# EAGLE design MCU Board (EAGLE 9.3.0)
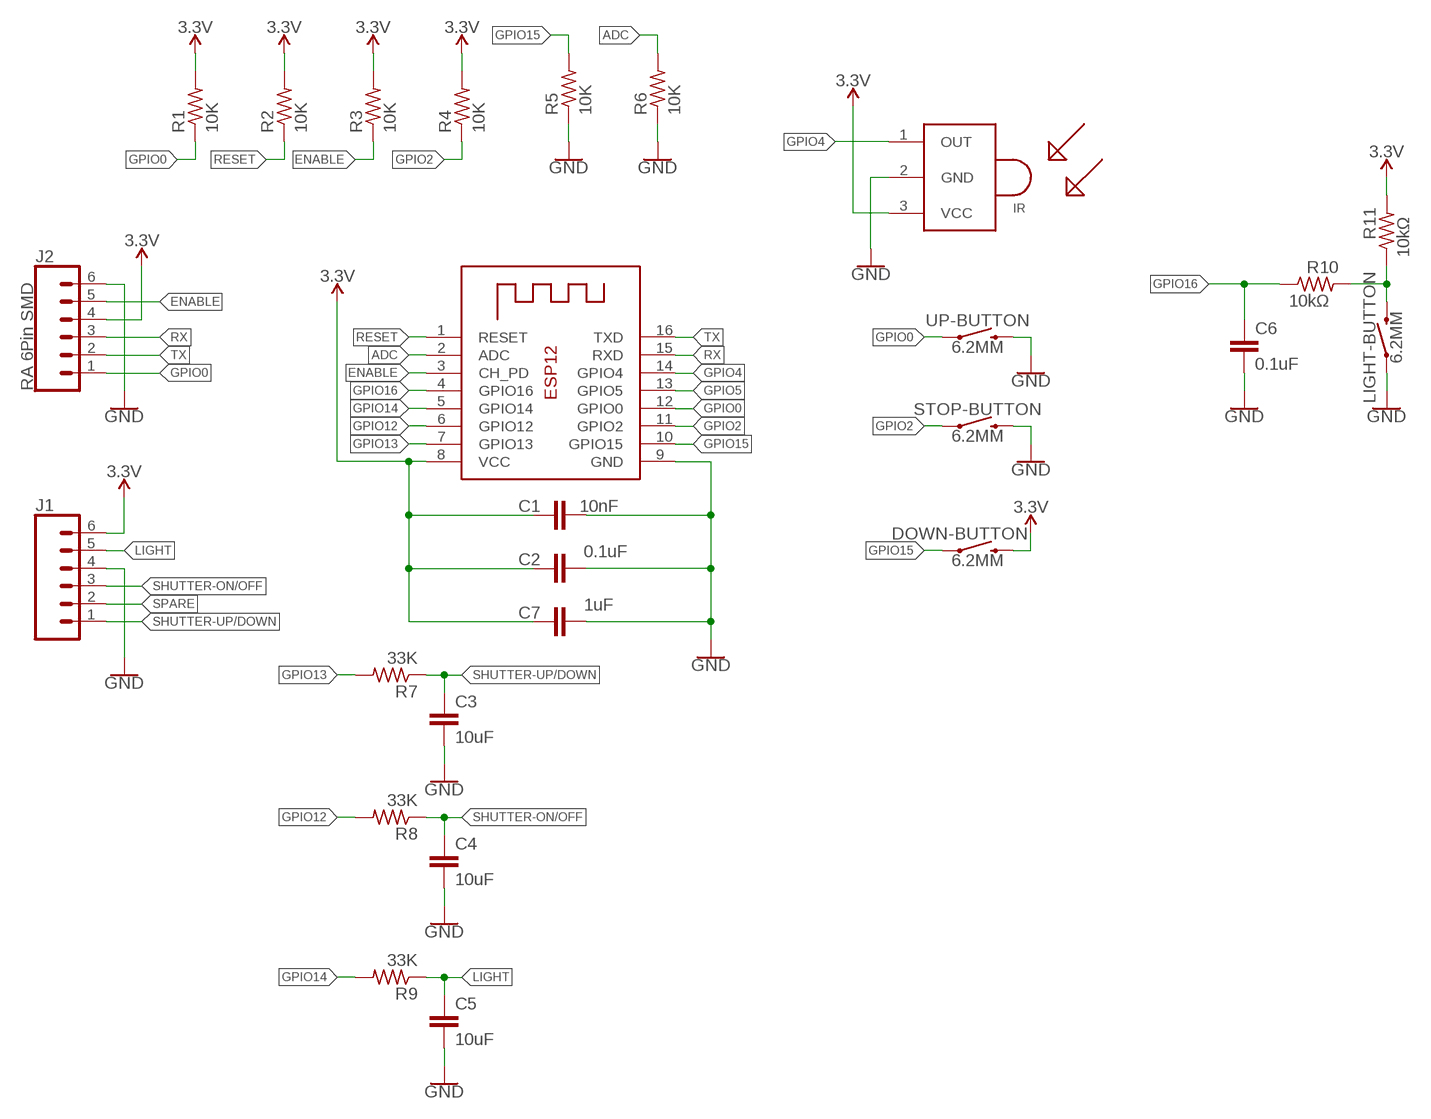
[diagram p0: schematic, sheet 1]

## Parts
C1  10nF  C-EUC0805  [C0805]
C2  0.1uF  C-EUC0805  [C0805]
C3  10uF  C-EUC0805  [C0805]
C4  10uF  C-EUC0805  [C0805]
C5  10uF  C-EUC0805  [C0805]
C6  0.1uF  C-EUC0805  [C0805]
C7  1uF  C-EUC0805  [C0805]
DOWN-BUTTON  6.2MM  MOMENTARY-SWITCH-SPST-SMD-6.2MM-TALL  [TACTILE_SWITCH_SMD_6.2MM_TALL]
IR  TSOP382  [TSOP382**-VERTICAL]
J1  CONN_06LOCK  [1X06_LOCK]
J2  RA 6Pin SMD  CONN_06SMD  [1X06-SMD_RA_MALE]
LIGHT-BUTTON  6.2MM  MOMENTARY-SWITCH-SPST-SMD-6.2MM-TALL  [TACTILE_SWITCH_SMD_6.2MM_TALL]
R1  10K  R-US_R0805  [R0805]
R2  10K  R-US_R0805  [R0805]
R3  10K  R-US_R0805  [R0805]
R4  10K  R-US_R0805  [R0805]
R5  10K  R-US_R0805  [R0805]
R6  10K  R-US_R0805  [R0805]
R7  33K  R-US_R0805  [R0805]
R8  33K  R-US_R0805  [R0805]
R9  33K  R-US_R0805  [R0805]
R10  10kΩ  R-US_R0805  [R0805]
R11  10kΩ  R-US_R0805  [R0805]
STOP-BUTTON  6.2MM  MOMENTARY-SWITCH-SPST-SMD-6.2MM-TALL  [TACTILE_SWITCH_SMD_6.2MM_TALL]
UP-BUTTON  6.2MM  MOMENTARY-SWITCH-SPST-SMD-6.2MM-TALL  [TACTILE_SWITCH_SMD_6.2MM_TALL]
X1  ESP-12  [ESP-12]

## Nets
3.3V: C1.1 C2.1 C7.1 DOWN-BUTTON.B2 IR.3(VCC) J1.6 J2.4 R1.2 R2.2 R3.2 R4.2 R11.2 X1.8(VCC)
ADC: R6.2 X1.2(ADC)
ENABLE: J2.5 R3.1 X1.3(CH_PD)
GND: C1.2 C2.2 C3.2 C4.2 C5.2 C6.2 C7.2 IR.2(GND) J1.4 J2.6 LIGHT-BUTTON.A2 R5.1 R6.1 STOP-BUTTON.B2 UP-BUTTON.B2 X1.9(GND)
GPIO0: J2.1 R1.1 UP-BUTTON.A2 X1.12(GPIO0)
GPIO2: R4.1 STOP-BUTTON.A2 X1.11(GPIO2)
GPIO4: IR.1(OUT) X1.14(GPIO4)
GPIO5: X1.13(GPIO5)
GPIO12: R8.2 X1.6(GPIO12)
GPIO13: R7.2 X1.7(GPIO13)
GPIO14: R9.2 X1.5(GPIO14)
GPIO15: DOWN-BUTTON.A2 R5.2 X1.10(GPIO15)
GPIO16: C6.1 R10.1 X1.4(GPIO16)
LIGHT: C5.1 J1.5 R9.1
N$4: LIGHT-BUTTON.B2 R10.2 R11.1
RESET: R2.1 X1.1(RESET)
RX: J2.3 X1.15(RXD)
SHUTTER-ON/OFF: C4.1 J1.3 R8.1
SHUTTER-UP/DOWN: C3.1 J1.1 R7.1
SPARE: J1.2
TX: J2.2 X1.16(TXD)

## Library data of the parts
C1-C7 = rcl:C-EU: CAPACITOR, European symbol; SPICEPREFIX: C
DOWN-BUTTON LIGHT-BUTTON STOP-BUTTON UP-BUTTON = SparkFun-Switches:MOMENTARY-SWITCH-SPST: Momentary Switch (Pushbutton) - SPST Normally-open (NO) SPST momentary switches (buttons, pushbuttons). Variants PTH-12MM - 12mm square, through-hole Momentary Pushbutton Switch - 12mm Square <https://www.sparkfun.com/products/9190> (COM-09190) PTH-6.0MM, PTH-6.0MM-KIT - 6.0mm square, through-hole Mini Pushbutton Switch <https://www.sparkfun.com/products/97> (COM-00097) KIT package intended for soldering kit's - only one side of pads' copper is exposed. PTH-RIGHT-ANGLE-KIT - Right-angle, through-hole Right Angle Tactile Button <https://www.sparkfun.com/products/10791> - Used on SparkFun BigTime Watch Kit <https://www.sparkfun.com/products/11734> SMD-12MM - 12mm square, surface-mount Tactile Button - SMD (12mm) <https://www.sparkfun.com/products/12993> (COM-12993) Used on SparkFun PicoBoard <https://www.sparkfun.com/products/11888> SMD-4.5MM - 4.5mm Square Trackball Switch Used on SparkFun Blackberry Trackballer Breakout <https://www.sparkfun.com/products/13169> SMD-4.6MMX2.8MM - 4.60mm x 2.80mm, surface mount Used on SparkFun SAMD21 Mini Breakout <https://www.sparkfun.com/products/13664> SMD-5.2MM, SMD-5.2-REDUNDANT - 5.2mm square, surface-mount Mini Pushbutton Switch - SMD <https://www.sparkfun.com/products/8720> (COM-08720) Used on Arduino Pro Mini <https://www.sparkfun.com/products/11114> REDUNDANT package connects both switch circuits together SMD-6.0X3.5MM - 6.0 x 3.5mm, surface mount Momentary Reset Switch SMD <https://www.sparkfun.com/products/8229> (COM-08229) SMD-6.2MM-TALL - 6.2mm square, surface mount Tactile Button - SMD (6mm) <https://www.sparkfun.com/products/12992> Used on SparkFun Digital Sandbox <https://www.sparkfun.com/products/12651> SMD-RIGHT-ANGLE - Right-angle, surface mount Used on SparkFun Block for Intel® Edison - Arduino <https://www.sparkfun.com/products/13036>; PROD_ID: SWCH-11966; SF_SKU: COM-12992
IR = LikeCircuit:TSOP382**: TSOP38230, TSOP38233, TSOP38236, TSOP38238, TSOP38240, TSOP38256
J1 = SparkFun-Connectors:CONN_06: Multi connection point. Often used as Generic Header-pin footprint for 0.1 inch spaced/style header connections On any of the 0.1 inch spaced packages, you can populate with these: Break Away Headers - Straight <https://www.sparkfun.com/products/116> (PRT-00116) Break Away Male Headers - Right Angle <https://www.sparkfun.com/products/553> (PRT-00553) Female Headers <https://www.sparkfun.com/products/115> (PRT-00115) Break Away Headers - Machine Pin <https://www.sparkfun.com/products/117> (PRT-00117) Break Away Female Headers - Swiss Machine Pin <https://www.sparkfun.com/products/743> (PRT-00743) Arduino Stackable Header - 6 Pin <https://www.sparkfun.com/products/9280> (PRT-09280) For SCREWTERMINALS and SPRING TERMINALS visit here: Screw Terimnals on SparkFun.com <https://www.sparkfun.com/search/results?term=Screw+Terminals> (5mm/3.5mm/2.54mm spacing) This device is also useful as a general connection point to wire up your design to another part of your project. Our various solder wires solder well into these plated through hole pads. Hook-Up Wire - Assortment (Stranded, 22 AWG) <https://www.sparkfun.com/products/11375> (PRT-11375) Hook-Up Wire - Assortment (Solid Core, 22 AWG) <https://www.sparkfun.com/products/11367> (PRT-11367) View the entire wire category on our website here <https://www.sparkfun.com/categories/141>
J2 = SparkFun-Connectors:CONN_06: Multi connection point. Often used as Generic Header-pin footprint for 0.1 inch spaced/style header connections On any of the 0.1 inch spaced packages, you can populate with these: Break Away Headers - Straight <https://www.sparkfun.com/products/116> (PRT-00116) Break Away Male Headers - Right Angle <https://www.sparkfun.com/products/553> (PRT-00553) Female Headers <https://www.sparkfun.com/products/115> (PRT-00115) Break Away Headers - Machine Pin <https://www.sparkfun.com/products/117> (PRT-00117) Break Away Female Headers - Swiss Machine Pin <https://www.sparkfun.com/products/743> (PRT-00743) Arduino Stackable Header - 6 Pin <https://www.sparkfun.com/products/9280> (PRT-09280) For SCREWTERMINALS and SPRING TERMINALS visit here: Screw Terimnals on SparkFun.com <https://www.sparkfun.com/search/results?term=Screw+Terminals> (5mm/3.5mm/2.54mm spacing) This device is also useful as a general connection point to wire up your design to another part of your project. Our various solder wires solder well into these plated through hole pads. Hook-Up Wire - Assortment (Stranded, 22 AWG) <https://www.sparkfun.com/products/11375> (PRT-11375) Hook-Up Wire - Assortment (Solid Core, 22 AWG) <https://www.sparkfun.com/products/11367> (PRT-11367) View the entire wire category on our website here <https://www.sparkfun.com/categories/141>; PROD_ID: CONN-08971
R1-R9 = rcl:R-US_: RESISTOR, American symbol; SPICEPREFIX: R
R10 R11 = adafruit:R-US_: RESISTOR, American symbol
X1 = adafruit:ESP-12

## Board
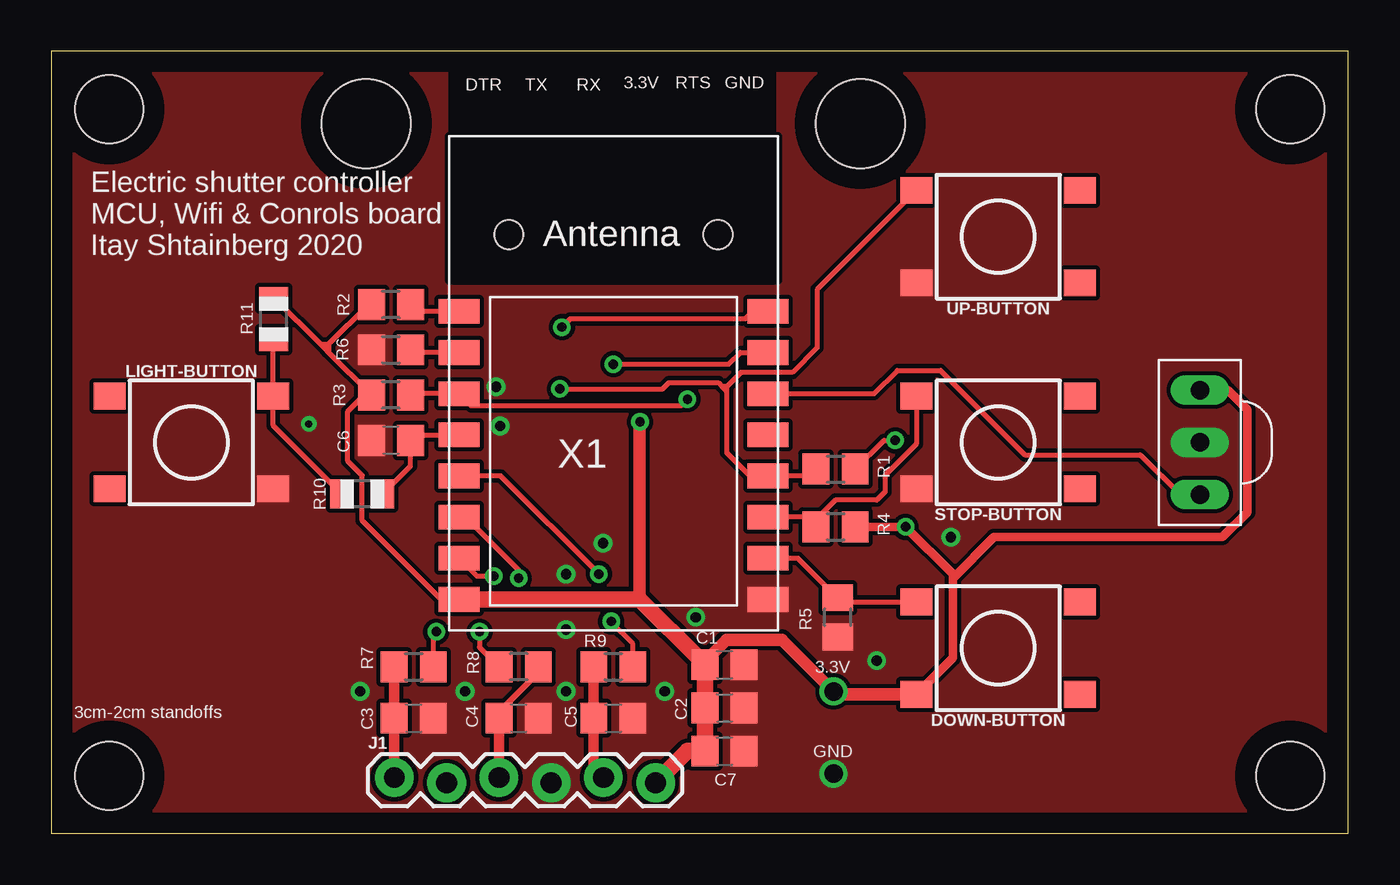
[diagram p1: board, top side]
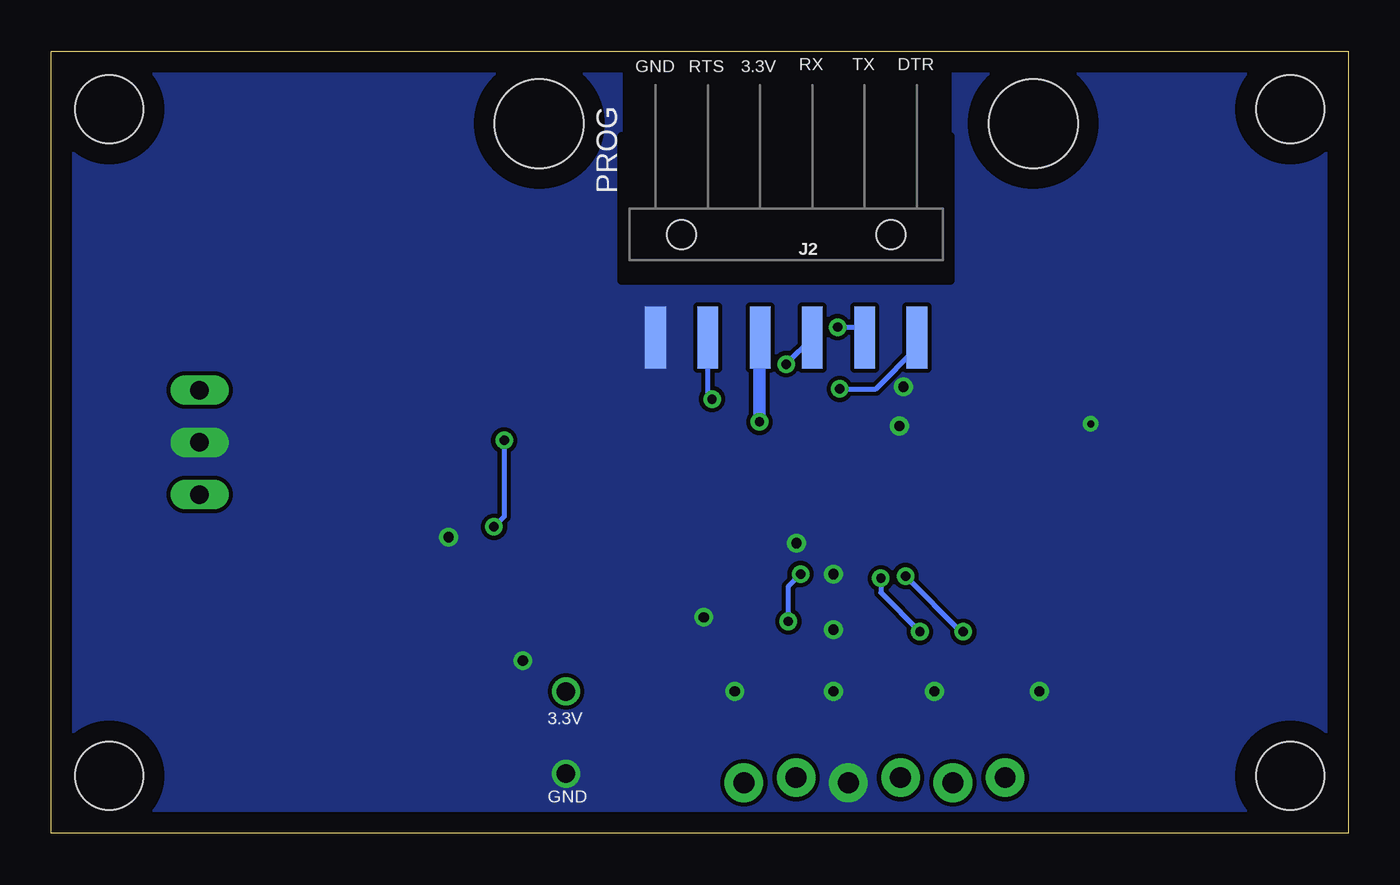
[diagram p2: board, bottom side, seen from below]

Size 63 x 38 mm. Coordinates in mm from the lower left corner, seen from the top.
Outline: 63,38 0,38 0,0 63,0 63,38
Copper layers (1*16): Top 0.035mm / dielectric 1.5mm / Bottom 0.035mm
Design rules "default": minimum track width 6mil, minimum drill 0.35mm, track to track 6mil, track to pad 6mil, pad to pad 6mil, via to via 6mil, smd to smd 6mil, copper to edge 40mil, drill to drill 6mil, minimum pad ring 10mil, minimum via ring 8mil, stop-mask expansion 4mil, vias tented up to drill 0mil, thermal gap 10mil
Holes 3.3 mm at 2.8,35.2 2.8,2.8 60.2,35.2 60.2,2.8
Holes 4.32 mm at 15.3,34.5 39.3,34.5

### Footprints (pad centres in the part's own frame; a part is rotated, then mirrored left to right if it is on the bottom)
C0805 = smd 1.3 x 1.5: 1 -0.95,0; 2 0.95,0
TACTILE_SWITCH_SMD_6.2MM_TALL = smd 1.55 x 1.3: A1 -3.975,-2.25; A2 3.975,-2.25; B1 -3.975,2.25; B2 3.975,2.25
TSOP382**-VERTICAL = drill 0.9 pad 1.422 long: 1 -2.54,0; 2 0,0; 3 2.54,0
1X06_LOCK = drill 1.016 pad 1.88: 1 0,0; 2 2.54,-0.254; 3 5.08,0; 4 7.62,-0.254; 5 10.16,0; 6 12.7,-0.254
1X06-SMD_RA_MALE = smd 1 x 3: 1 -6.35,5; 2 -3.81,5; 3 -1.27,5; 4 1.27,5; 5 3.81,5; 6 6.35,5 | hole 1.4: -5.08,0; 5.08,0
R0805 = smd 1.3 x 1.5: 1 -0.95,0; 2 0.95,0
R0805' = smd 1.1 x 1.4: 1 -1,0; 2 1,0
ESP-12 = smd 2 x 1.2: 1 -7.5,4.5; 2 -7.5,2.5; 3 -7.5,0.5; 4 -7.5,-1.5; 5 -7.5,-3.5; 6 -7.5,-5.5; 7 -7.5,-7.5; 8 -7.5,-9.5; 9 7.5,-9.5; 10 7.5,-7.5; 11 7.5,-5.5; 12 7.5,-3.5; 13 7.5,-1.5; 14 7.5,0.5; 15 7.5,2.5; 16 7.5,4.5

### Placement (x,y rotation side)
C1  32.7,8.2 0 top
C2  32.7,6.1 0 top
C3  17.6,5.6 0 top
C4  22.7,5.6 0 top
C5  27.3,5.6 0 top
C6  16.5,19.1 180 top
C7  32.7,4 0 top
DOWN-BUTTON  46,9 180 top
IR  55.8,19 90 top
J1  16.66,2.71 0 top
J2  27.3,29.1 180 bottom
LIGHT-BUTTON  6.8,19 0 top
R1  38.1,17.7 0 top
R2  16.5,25.7 180 top
R3  16.5,21.3 180 top
R4  38.1,14.9 0 top
R5  38.2,10.5 90 top
R6  16.5,23.5 0 top
R7  17.6,8.1 0 top
R8  22.7,8.1 180 top
R9  27.3,8.1 0 top
R10  10kΩ  [R0805']  15.1,16.5 180 top
R11  10kΩ  [R0805']  10.8,25 90 top
STOP-BUTTON  46,19 180 top
UP-BUTTON  46,29 180 top
X1  27.31,20.87 0 top

### Tracks (layer width: path | path; a pad name or v marks a point on that pad's centre or on a via)
3.3V  (via drill 0.45, 0.9)
  Top 0.254: X1.8 18.93,11.37 15.1,15.2 15.1,17.4 14.4,18.1 14.4,20.5 15.2,21.3 R3.2 13.47,23.38 | 13.47,23.38 13.3,23.55 | 13.3,23.55 13.3,23.6 13.47,23.77 | 13.47,23.77 15.4,25.7 R2.2 | 13.3,23.55 13.07,23.77 | 13.07,23.77 10.85,26 R11.2 | 13.07,23.77 13.47,23.77 | 13.47,23.77 13.47,23.38 | R1.2 40.45,19.1 v41,19.1
  Top 0.406: DOWN-BUTTON.B2 43.8,8.53 43.8,12.4 | 43.8,12.4 43.8,12.6 v41.5,14.9 R4.2 | 43.8,12.4 45.8,14.4 56.9,14.4 58.1,15.6 58.1,20.6 57.16,21.54 IR.3
  Top 0.61: 28.58,11.37 28.58,19.98 v28.6,20 | DOWN-BUTTON.B2 38.15,6.75 v38,6.9 35.49,9.41 32.81,9.41 31.83,8.43 31.52,8.43
  Top 0.813: X1.8 28.58,11.37 31.52,8.43 C1.1 C2.1 C7.1 30.9,4 J1.6
  Bottom 0.254: v41,19.1 41,15.4 v41.5,14.9
  Bottom 0.61: v28.6,20 28.6,24.07 J2.4
ADC
  Top 0.254: X1.2 17.58,23.37 R6.2
ENABLE  (via drill 0.45)
  Top 0.254: R3.1 17.52,21.37 X1.3 20.41,20.77 30.57,20.77 v30.9,21.1
  Bottom 0.254: v30.9,21.1 31.11,21.31 J2.5
GND  (via drill 0.35, 0.5, 0.9)
  other vias: 38,2.9 26.8,14.1 25,12.6 25,9.9 25,6.9 20.1,6.9 15,6.9 31.3,10.5 29.8,6.9 40.1,8.4 21.6,21.7 21.8,19.8 43.7,14.4 12.5,19.9
  pour Top (isolate 0.203, no thermals): 0,38 19.2,38 19.2,26.9 35.3,26.9 35.3,38 63,38 63,0 0,0
  pour Bottom (isolate 0.203, no thermals): 0,38.5 19.2,38.5 19.2,26.9 35.3,26.9 35.3,38.6 63,38.5 63,0.5 0,0.5
GPIO0  (via drill 0.45)
  Top 0.254: R1.1 36.82,17.37 X1.12 33.93,17.37 32.8,18.5 32.8,21.5 | UP-BUTTON.A2 37.2,26.43 37.2,23.6 36,22.4 33.5,22.4 32.85,21.75 | v24.7,21.6 29.7,21.6 30,21.9 32.4,21.9 32.55,21.75 | 32.55,21.75 32.8,21.5 | 32.85,21.75 32.8,21.7 32.8,21.5 | 32.55,21.75 32.85,21.75
  Bottom 0.254: J2.1 20.95,23.6 22.95,21.6 v24.7,21.6
GPIO2
  Top 0.254: STOP-BUTTON.A2 42.02,18.93 40.5,17.4 40.5,16.6 40.1,16.2 38.1,16.2 37.15,15.25 R4.1 36.68,15.37 X1.11
GPIO4
  Top 0.254: X1.14 39.97,21.37 41.1,22.5 43.2,22.5 47.3,18.4 52.9,18.4 54.84,16.46 IR.1
GPIO12  (via drill 0.45)
  Top 0.254: X1.6 20.13,15.37 22.7,12.8 v22.7,12.4 | v20.8,9.8 20.8,9.05 R8.2
  Bottom 0.254: v22.7,12.4 22.7,11.7 v20.8,9.8
GPIO13  (via drill 0.45)
  Top 0.254: X1.7 20.68,12.5 v21.5,12.5 | v18.7,9.8 18.55,9.65 R7.2
  Bottom 0.254: v21.5,12.5 18.8,9.8 v18.7,9.8
GPIO14  (via drill 0.45)
  Top 0.254: R9.2 28.25,9.2 27.2,10.25 v27.2,10.3 | v26.6,12.6 21.83,17.37 X1.5
  Bottom 0.254: v27.2,10.3 27.2,12 v26.6,12.6
GPIO15
  Top 0.254: X1.10 36.28,13.37 R5.2 38.4,11.25 DOWN-BUTTON.A2
GPIO16
  Top 0.254: R10.1 17.45,17.85 C6.1 17.72,19.37 X1.4
LIGHT
  Top 0.508: J1.5 26.35,3.18 C5.1 R9.1
N$4
  Top 0.254: R10.2 10.78,19.82 LIGHT-BUTTON.B2 10.78,23.98 R11.1
RESET
  Top 0.254: X1.1 17.78,25.37 R2.1
RX  (via drill 0.45)
  Top 0.254: v27.3,22.8 32.9,22.8 33.47,23.37 X1.15
  Bottom 0.254: J2.3 26.03,24.07 v27.3,22.8
SHUTTER-ON/OFF
  Top 0.305: C4.1 21.75,5.9 23.65,7.8 R8.1
  Top 0.508: C4.1 J1.3
SHUTTER-UP/DOWN
  Top 0.508: J1.1 C3.1 R7.1
TX  (via drill 0.45)
  Top 0.254: X1.16 34.07,25.37 33.7,25 25.2,25 v24.8,24.6
  Bottom 0.254: v24.8,24.6 23.99,24.6 J2.2

### Text on the board
tNames: DTR | TX | RX | 3.3V | RTS | GND | Electric shutter controller / MCU, Wifi & Conrols board / Itay Shtainberg 2020 | 3.3V | 3cm-2cm standoffs | GND
bNames: DTR | TX | RX | 3.3V | RTS | GND | PROG | 3.3V | GND